# EAGLE board RePhone core 2G-Atmel32u4 v1.0 (EAGLE 6.4)
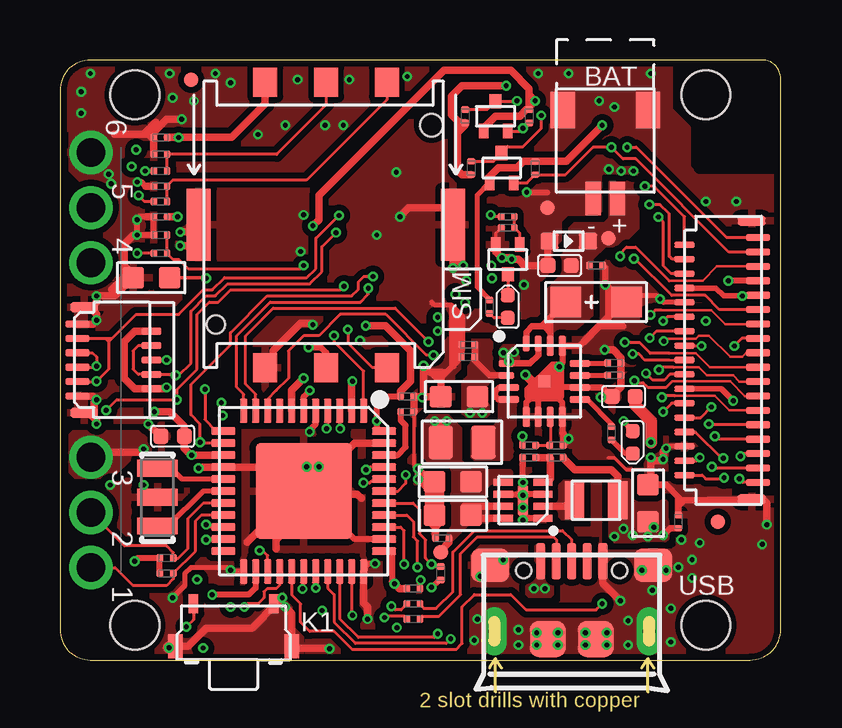
[diagram p2: board, top side]
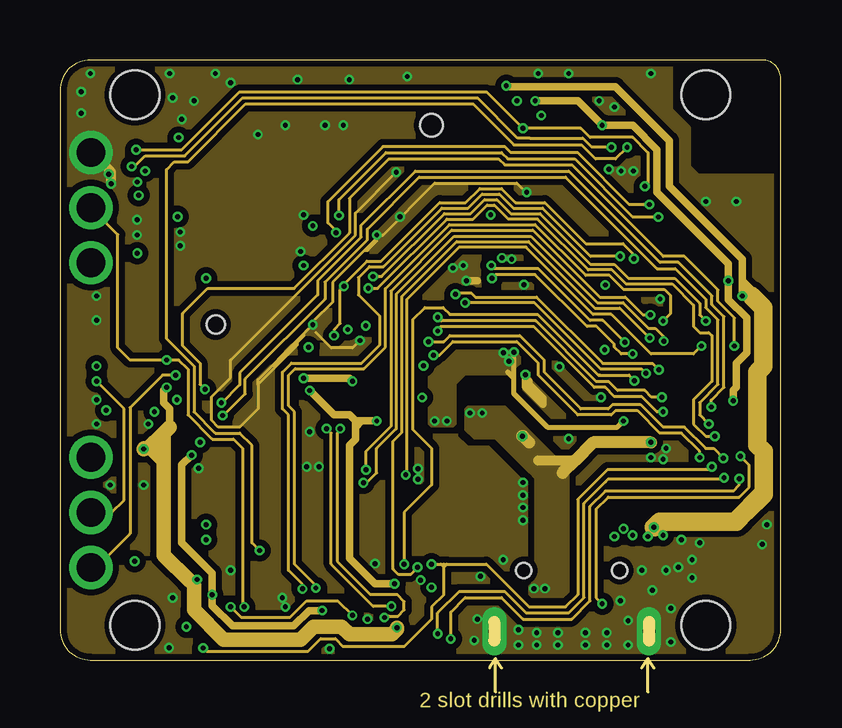
[diagram p3: board, inner layer Route2]
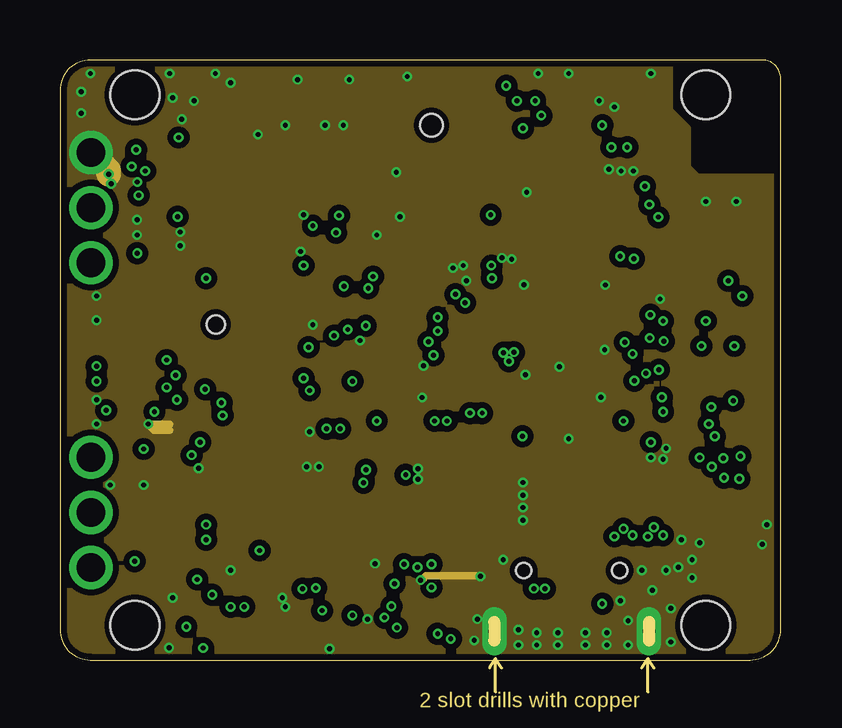
[diagram p4: board, inner layer GND]
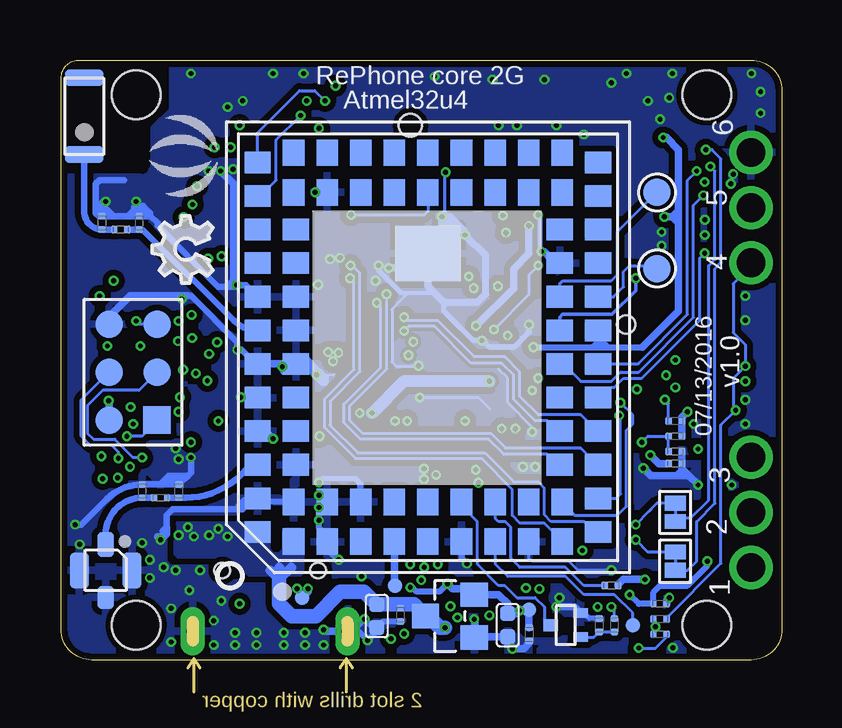
[diagram p5: board, bottom side, seen from below]

Size 30.05 x 25 mm. Coordinates in mm from the lower left corner, seen from the top.
Outline: 1.27,25 arc90 0,23.73 0,1.27 arc90 1.27,0 28.78,0 arc90 30.05,1.27 30.05,24.24 arc90 29.29,25 1.27,25
Copper layers (1*2*15*16): Top 0.035mm / dielectric 0.2mm / Route2 0.0175mm / dielectric 0.3mm / GND 0.0175mm / dielectric 0.2mm / Bottom 0.035mm
Design rules "SeeedStudio_4layer_DRU_no_angle_20140221 *": minimum track width 1mil, minimum drill 8mil, track to track 4mil, track to pad 4mil, pad to pad 5mil, via to via 5mil, smd to smd 0mil, copper to edge 10mil, drill to drill 6mil, minimum pad ring 6mil, minimum via ring 4mil, stop-mask expansion 4mil, vias tented up to drill 100mil, thermal gap 10mil
Holes 2.03 mm at 3.12,1.45 3.12,23.55 26.92,23.55 26.92,1.45
tRestrict: area 26.7,20.5 to 31.1,25.6
bRestrict: area 26.7,20.5 to 31.1,25.6

## Footprints (pad centres in the part's own frame; a part is rotated, then mirrored left to right if it is on the bottom)
ANT-SMD2P-3.2X1.6X1.04MM = smd 1.6 x 0.7: 1 0,1.6; 2 0,-1.6
C0201 = smd 0.279 x 0.318: 1 -0.279,0; 2 0.279,0
C0402 = smd 0.635 x 0.635: 1 0,0.484; 2 0,-0.484
C0603 = smd 0.889 x 0.889: 1 0,0.762; 2 0,-0.762
AVX-A = smd 1.27 x 1.27: + -1.27,0; - 1.27,0
LED-0402 = smd 0.58 x 0.58: + -0.468,0; - 0.468,0
SOD-523 = smd 0.762 x 0.7: + -0.8,0; - 0.8,0
ANT-IPEX4-1.7X1.7MM = smd 0.7 x 1.05: 1 0,-1.075 | smd 0.8 x 1.5: 2 1.1,0; 4 -1.1,0 | smd 0.7 x 0.95: 3 0,1.125
FPC11-SMD-0.3(FH35C) = smd 0.3 x 1: 1 -1.5,-3.075; 3 -0.9,-3.075; 5 -0.3,-3.075; 7 0.3,-3.075; 9 0.9,-3.075; 11 1.5,-3.075 | smd 0.3 x 0.85: 2 -1.2,0; 4 -0.6,0; 6 0,0; 8 0.6,0; 10 1.2,0 | smd 0.4 x 1.15: P$1 2.2,-2.8; P$2 -2.2,-2.8
MICRO-USB5+4P-SMD-0.65-B = smd 0.381 x 1.524: 1 -1.3,-0.25; 2 -0.65,-0.25; 3 0,-0.25; 4 0.65,-0.25; 5 1.3,-0.25 | smd 1.6 x 1.397: S1 -3.4,-0.427; S6 3.4,-0.427 | drill 0.508 pad 1.016 long: S2 -3.226,-3.175; S5 3.226,-3.175 | smd 1.5 x 1.5: S3 -1,-3.5; S4 1,-3.5 | hole 0.635: -2,-0.65; 2,-0.65
FPC35-SMD-0.3(FH26W) = smd 0.3 x 1: 1 -5.1,-1.551; 3 -4.5,-1.551; 5 -3.9,-1.551; 7 -3.3,-1.551; 9 -2.7,-1.551; 11 -2.1,-1.551; 13 -1.5,-1.551; 15 -0.9,-1.551; 17 -0.3,-1.551; 19 0.3,-1.551; 21 0.9,-1.551; 23 1.5,-1.551; 25 2.1,-1.551; 27 2.7,-1.551; 29 3.3,-1.551; 31 3.9,-1.551; 33 4.5,-1.551; 35 5.1,-1.551 | smd 0.254 x 0.851: 2 -4.8,1.524; 4 -4.2,1.524; 6 -3.6,1.524; 8 -3,1.524; 10 -2.4,1.524; 12 -1.8,1.524; 14 -1.2,1.524; 16 -0.6,1.524; 18 0,1.524; 20 0.6,1.524; 22 1.2,1.524; 24 1.8,1.524; 26 2.4,1.524; 28 3,1.524; 30 3.6,1.524; 32 4.2,1.524; 34 4.8,1.524 | smd 0.4 x 1.15: P$1 5.8,-1.276; P$2 -5.8,-1.276
HW2-SMD-1.0-90D = smd 1.524 x 1.016: 3 -3.429,1.778; 4 -3.429,-1.778 | smd 1.397 x 0.635: + 0.254,0.508; - 0.254,-0.508
H2X3-SMD-2.0(1.143) = smd 1.143 x 1.143: 1 -1,2; 2 -1,0; 3 -1,-2; 4 1,-2; 5 1,0; 6 1,2
3P-DIP-2 = drill 1.2 pad 1.8: 1 -2.3,-0.02; 2 0,-0.02; 3 2.3,-0.02
SW4-SMD-4.5X3.8X1.8MM-90D = smd 0.4 x 0.8: 1 -1.675,-1.277; 2 1.675,-1.277 | smd 0.6 x 1: S1 -2.425,0.5; S2 2.425,0.5
L0805 = smd 1.016 x 1.397: 1 -0.889,0; 2 0.889,0
L201610 = smd 0.8 x 1.6: 1 -0.9,0; 2 0.9,0
SOT-523 = smd 0.4 x 0.6: 1 0.5,0.62; 2 -0.5,0.62 | smd 0.5 x 0.6: 3 0,-0.62
R0201 = smd 0.279 x 0.318: 1 -0.279,0; 2 0.279,0
NANO-SIM6+2P-SMD-12.3X10X1.5MM = smd 1 x 1.2: 1 6.94,-1.8; 2 4.4,-1.8; 3 1.86,-1.8; 5 6.94,10.1; 6 4.4,10.1; 7 1.86,10.1 | smd 1 x 3: 4 9.71,4.15; 8 -0.9,4.15 | hole 0.95: 0,0 | hole 0.75: 9,8.3
TP-D23MIL = smd 0.6 x 0.6: T 0,0
TP-D45MIL = smd 1.143 x 1.143: T 0,0
GPRS88-SMD-1.4-17.8X45.8X2.4MM = smd 1.1 x 0.9: 1 -8.1,5.6; 2 -8.1,4.2; 3 -8.1,2.8; 4 -8.1,1.4; 5 -8.1,0; 6 -8.1,-1.4; 7 -8.1,-2.8; 8 -8.1,-4.2; 9 -8.1,-5.6; 22 8.1,-5.6; 23 8.1,-4.2; 24 8.1,-2.8; 25 8.1,-1.4; 26 8.1,0; 27 8.1,1.4; 28 8.1,2.8; 29 8.1,4.2; 30 8.1,5.6; 43 -6.45,5.6; 44 -6.45,4.2; 45 -6.45,2.8; 46 -6.45,1.4; 47 -6.45,0; 48 -6.45,-1.4; 49 -6.45,-2.8; 50 -6.45,-4.2; 51 -6.45,-5.6; 60 6.45,-5.6; 61 6.45,-4.2; 62 6.45,-2.8; 63 6.45,-1.4; 64 6.45,0; 65 6.45,1.4; 66 6.45,2.8; 67 6.45,4.2; 68 6.45,5.6 | smd 0.9 x 1.1: 10 -7.7,-7.1; 11 -6.3,-7.1; 12 -4.9,-7.1; 13 -3.5,-7.1; 14 -2.1,-7.1; 15 -0.7,-7.1; 16 0.7,-7.1; 17 2.1,-7.1; 18 3.5,-7.1; 19 4.9,-7.1; 20 6.3,-7.1; 21 7.7,-7.1; 31 7.7,7.1; 32 6.3,7.1; 33 4.9,7.1; 34 3.5,7.1; 35 2.1,7.1; 36 0.7,7.1; 37 -0.7,7.1; 38 -2.1,7.1; 39 -3.5,7.1; 40 -4.9,7.1; 41 -6.3,7.1; 42 -7.7,7.1; 52 -4.9,-5.5; 53 -3.5,-5.5; 54 -2.1,-5.5; 55 -0.7,-5.5; 56 0.7,-5.5; 57 2.1,-5.5; 58 3.5,-5.5; 59 4.9,-5.5; 69 4.9,5.5; 70 3.5,5.5; 71 2.1,5.5; 72 0.7,5.5; 73 -0.7,5.5; 74 -2.1,5.5; 75 -3.5,5.5; 76 -4.9,5.5 | smd 2.3 x 2.7: 83 3.9,0
SOT-23 = smd 1.016 x 1.143: 1 -0.889,-1.016; 2 0.889,-1.016; 3 0,1.016
QFN16GA-0.5-3X3MM = smd 0.65 x 0.28: 1 -1.575,0.75; 2 -1.575,0.25 | smd 0.85 x 0.28: 3 -1.475,-0.25; 4 -1.475,-0.75; 9 1.475,-0.75; 10 1.475,-0.25; 11 1.475,0.25; 12 1.475,0.75 | smd 0.28 x 0.85: 5 -0.75,-1.475; 6 -0.25,-1.475; 7 0.25,-1.475; 8 0.75,-1.475; 13 0.75,1.475; 14 0.25,1.475 | smd 0.28 x 0.65: 15 -0.25,1.575; 16 -0.75,1.575 | smd 0.508 x 0.508: PAD 0,0
QFN44G-0.5-7X7MM = smd 1 x 0.3: 1 -3.35,2.5; 2 -3.35,2; 3 -3.35,1.5; 4 -3.35,1; 5 -3.35,0.5; 6 -3.35,0; 7 -3.35,-0.5; 8 -3.35,-1; 9 -3.35,-1.5; 10 -3.35,-2; 11 -3.35,-2.5; 23 3.35,-2.5; 24 3.35,-2; 25 3.35,-1.5; 26 3.35,-1; 27 3.35,-0.5; 28 3.35,0; 29 3.35,0.5; 30 3.35,1; 31 3.35,1.5; 32 3.35,2; 33 3.35,2.5 | smd 0.3 x 1: 12 -2.5,-3.35; 13 -2,-3.35; 14 -1.5,-3.35; 15 -1,-3.35; 16 -0.5,-3.35; 17 0,-3.35; 18 0.5,-3.35; 19 1,-3.35; 20 1.5,-3.35; 21 2,-3.35; 22 2.5,-3.35; 34 2.5,3.35; 35 2,3.35; 36 1.5,3.35; 37 1,3.35; 38 0.5,3.35; 39 0,3.35; 40 -0.5,3.35; 41 -1,3.35; 42 -1.5,3.35; 43 -2,3.35; 44 -2.5,3.35 | smd 4 x 4: TAB 0,0
DFN8G-0.5-2X2MM = smd 0.8 x 0.3: 1 -0.827,0.75; 2 -0.827,0.25; 3 -0.827,-0.25; 4 -0.827,-0.75; 5 0.827,-0.75; 6 0.827,-0.25; 7 0.827,0.25; 8 0.827,0.75 | smd 0.45 x 1.3: 9 0,0
2P-SMD-SHORT = smd 0.889 x 0.61: 1 0,0.381; 2 0,-0.381
RESONATOR3-SMD-3.6X1.3X0.8MM = smd 0.7 x 1.7: 1 -1.2,0; 2 0,0; 3 1.2,0

## Placement (x,y rotation side)
BT  AN3216  [ANT-SMD2P-3.2X1.6X1.04MM]  29.08,22.66 180 bottom
C1  100nF  [C0201]  15.9,1.88 90 bottom
C2  100nF  [C0201]  4.19,21.77 180 top
C3  27pF  [C0201]  4.19,19.74 0 top
C4  1uF  [C0402]  11.43,1.45 180 bottom
C5  10uF  [C0603]  24.51,6.53 0 top
C6  27pF  [C0201]  4.19,21.07 0 top
C7  27pF  [C0201]  4.19,17.71 0 top
C9  10uF  [C0603]  16.64,10.98 270 top
C10  100nF  [C0201]  17.02,12.63 180 top
C13  10uF  [C0603]  16.38,7.42 270 top
C14  100nF  [C0201]  4.19,18.47 180 top
C15  1uF  [C0402]  16.89,1.83 180 bottom
C16  100nF  [C0201]  10.54,1.07 90 bottom
C18  22uF  [AVX-A]  22.35,14.91 0 top
C19  100nF  [C0201]  25.78,5.77 270 top
C21  10uF  [C0603]  16.38,6.02 90 top
C22  DNP  [C0201]  26.67,7.04 90 bottom
C23  1uF  [C0402]  23.5,10.98 270 top
C24  100nF  [C0201]  22.35,16.44 0 top
C25  1uF  [C0402]  20.83,16.44 270 top
C26  4.7uF  [C0603]  3.81,15.93 270 top
C27  100nF  [C0201]  15.94,5.07 0 top
C28  DNP  [C0201]  25.15,7.04 90 bottom
C29  DNP  [C0201]  28.35,18.21 270 bottom
C30  DNP  [C0201]  26.8,18.21 270 bottom
C44  100nF  [C0201]  4.45,8.18 180 bottom
C45  100nF  [C0201]  14.73,2.97 180 top
C46  100nF  [C0201]  5.08,2.34 180 bottom
C47  100nF  [C0201]  14.48,10.98 180 top
C48  100nF  [C0201]  14.48,10.34 180 top
C49  1uF  [C0402]  4.7,9.32 90 top
C50  100nF  [C0201]  4.45,8.69 180 bottom
D1  Green  [LED-0402]  23.88,9.07 270 top
D2  Prisemi;PZ5D4V2H  [SOD-523]  21.21,17.45 0 top
D3  BLue  [LED-0402]  18.67,14.72 90 top
FR1  [SEEEDSTUDIO-PCB-FRAME]  -15.87,-50.49 0 top  (outside the outline)
FR2  [SEEEDSTUDIO-PCB-FRAME]  -15.75,-18.23 0 top  (outside the outline)
GSM  IPEX  [ANT-IPEX4-1.7X1.7MM]  28.19,3.74 180 bottom
J1  FH35C-11S-0.3SHW(50)  [FPC11-SMD-0.3(FH35C)]  3.81,12.5 270 top
J2  Micro-USB  [MICRO-USB5+4P-SMD-0.65-B]  21.34,4.37 0 top
J3  FH26-35S-0.3SHW  [FPC35-SMD-0.3(FH26W)]  27.56,12.5 90 top
J4  SMD FEMALE JST;2P-1.0-90D  [HW2-SMD-1.0-90D]  22.73,19.48 270 top
J6  ISP  [H2X3-SMD-2.0(1.143)]  27.05,11.99 180 bottom
J9  DNP  [3P-DIP-2]  1.27,18.85 90 top
J10  DNP  [3P-DIP-2]  1.27,6.15 90 top
K1  BUTTON-2P-REINFORCE;HQ-TP-1100A  [SW4-SMD-4.5X3.8X1.8MM-90D]  7.24,1.07 180 top
L3  2.2uH  [L0805]  16.76,9.07 180 top
L4  0.47uH  [L201610]  22.35,6.66 0 top
Q4  CJ1012  [SOT-523]  18.67,16.69 0 top
Q5  CJ1012  [SOT-523]  9.02,1.45 270 bottom
Q7  CJ1012  [SOT-523]  18.41,20.5 180 top
Q8  CJ1012  [SOT-523]  18.16,22.66 180 top
R1  4.7k  [R0201]  6.98,1.45 270 bottom
R2  51R  [R0201]  4.19,19.1 0 top
R3  51R  [R0201]  4.19,20.37 0 top
R4  51R  [R0201]  4.19,16.95 180 top
R5  DNP  [R0201]  4.45,9.96 180 bottom
R6  4.7k  [R0201]  17.14,20.5 90 top
R7  4.7k  [R0201]  17.91,14.72 90 top
R8  4.7k  [R0201]  16.89,22.66 90 top
R9  47k  [R0201]  18.67,18.01 180 top
R10  4.7k  [R0201]  19.81,20.5 270 top
R11  220k_1%  [R0201]  20.7,8.44 0 top
R12  DNP  [R0201]  5.08,1.71 0 bottom
R13  47k  [R0201]  7.62,1.45 90 bottom
R14  4.7k  [R0201]  18.67,18.47 0 top
R15  0R  [R0201]  5.08,1.07 0 bottom
R16  4.7k  [R0201]  15.88,3.61 90 top
R17  4.7k  [R0201]  7.11,3.1 0 bottom
R18  0R  [R0201]  27.56,17.94 180 bottom
R22  0R  [R0201]  25.91,6.76 180 bottom
R25  10k_1%  [R0201]  4.45,9.32 0 bottom
R26  4.7k  [R0201]  4.45,3.61 180 top
R27  4.7k  [R0201]  4.45,4.24 180 top
R28  4.7k  [R0201]  19.56,22.66 270 top
R29  39k_1%  [R0201]  19.56,8.44 0 top
R35  2k  [R0201]  23.11,12.37 0 top
R36  2k  [R0201]  23.11,11.87 0 top
R37  2k  [R0201]  22.99,9.45 90 top
R38  DNP  [R0201]  19.56,8.94 180 top
R39  0R  [R0201]  20.7,8.94 0 top
R40  1M  [R0201]  17.02,13.13 180 top
R41  22R  [R0201]  14.73,1.71 180 top
R42  22R  [R0201]  14.73,2.34 180 top
SIM  Nano SIM CARD CONNECTOR 6Pin SMT TYPE  [NANO-SIM6+2P-SMD-12.3X10X1.5MM]  15.49,22.28 180 top
TP1  [TP-D23MIL]  16.13,3.1 90 bottom
TP2  [TP-D45MIL]  5.21,19.48 90 bottom
TP3  [TP-D45MIL]  5.21,16.31 90 bottom
TP4  [TP-D23MIL]  6.22,1.45 90 bottom
TP5  [TP-D23MIL]  20.02,2.59 0 bottom
TP6  [TP-D23MIL]  15.88,4.5 0 top
TP7  [TP-D23MIL]  10.54,2.09 0 bottom
TP8  [TP-D23MIL]  27.43,5.77 0 top
TP9  [TP-D23MIL]  5.46,24.18 0 top
TP10  [TP-D23MIL]  22.86,17.58 270 top
TP11  [TP-D23MIL]  20.32,18.85 90 top
U1  SIM800H  [GPRS88-SMD-1.4-17.8X45.8X2.4MM]  14.76,13.03 90 bottom
U2  XC6206P332MR  [SOT-23]  13.84,1.83 90 bottom
U3  ETA6003  [QFN16GA-0.5-3X3MM]  20.19,11.61 0 top
U4  ATMEGA32U4-MUR  [QFN44G-0.5-7X7MM]  10.16,7.04 270 top
U6  ETA3410  [DFN8G-0.5-2X2MM]  19.3,6.66 180 top
U$1  [SEEEDSTUDIO-PCB-FRAME]  -16.26,-42.36 0 top  (outside the outline)
U$2  [SEEED-SILK-160*153MIL]  25.04,21.03 90 bottom
U$3  [SEEEDSTUDIO-PCB-FRAME]  -16.26,-35.25 0 top  (outside the outline)
U$5  [SEEEDSTUDIO-PCB-FRAME]  -16,-26.62 0 top  (outside the outline)
U$14  [OSHW_FILLX100_NOTEXT]  23.72,15.7 90 bottom
U$21  JUMPER-2P-SHORT  [2P-SMD-SHORT]  4.45,6.15 180 bottom
U$42  JUMPER-2P-SHORT  [2P-SMD-SHORT]  4.45,4.12 180 bottom
X1  16MHz-15pF-0.5%-40R  [RESONATOR3-SMD-3.6X1.3X0.8MM]  4.06,6.79 90 top

## Tracks (layer width: path | path; a pad name or v marks a point on that pad's centre or on a via)
3V3  (via drill 0.2 pad 0.36)
  Top 0.203: R7.2 17.91,15.04 17.4,15.55 17.4,19.37 Q7.1
  Top 0.229: J3.14 27.56,11.3 v28.07,10.8
  Top 0.254: U4.6 10.16,10.98 v10.41,11.23 | U4.24 8.16,3.01 7.87,2.72 v6.35,2.72 | R26.2 R27.2 3.24,4.24 v3.11,4.12 | U4.44 13.38,9.54 13.21,9.71 v13.21,9.96 13.21,10.6 13.59,10.98 C47.2 | J3.29 v27.87,15.8 v27.86,15.8 | U4.34 13.68,4.54 13.84,4.37 13.84,3.28 v13.95,3.18 | R16.1 15.8,3.33 v15.49,3.03
  Top 0.305: U4.14 v5.48,8.54 5.46,8.54 5.18,8.82 C49.2 5.18,9.73 4.57,10.34 v3.94,10.34 | C47.2 14.2,11.21 14.61,11.61 14.61,12.88 13.56,13.92 v12.75,13.92 | Q7.1 17.91,20.13 18.29,20.5 19.05,20.5 19.33,20.78 R10.1 21.11,20.78 v22.61,22.28 | 19.56,23.55 v19.81,23.3 19.56,23.04 R28.1 | C45.2 14.15,2.97 v13.95,3.18 | v10.54,18.09 10.79,18.34 10.79,19.36 16,24.56 18.8,24.56 19.56,23.8 19.56,23.55 | Q8.1 17.66,22.16 18.16,22.66 19.18,22.66 19.46,22.94 R28.1 | R28.1 19.56,23.55
  Route2 0.305: 5.46,8.52 v5.48,8.54 5.08,8.13 5.08,4.88 6.35,3.61 v6.35,2.72 6.35,2.27 7.19,1.42 9.75,1.42 10.39,2.06 v10.94,2.06 | 12.32,9.71 12.32,9.2 12.07,8.94 12.07,4.24 13.13,3.18 v13.95,3.18 | 12.32,9.71 12.32,9.96 | v10.41,11.23 11.43,10.21 12.07,10.21 12.32,9.96 | v19.81,23.3 21.59,23.3 v22.61,22.28 23.88,22.28 24.89,21.26 24.89,19.48 27.86,16.51 v27.86,15.8 27.86,15.02 28.63,14.25 28.63,12.8 28.19,12.37 28.19,11.36 28.07,11.23 v28.07,10.8 | 12.32,9.96 12.57,9.96 | 12.57,9.96 v13.21,9.96 | 12.57,9.96 12.32,9.71
  Bottom 0.254: 13.08,2.97 U2.2 | v6.35,2.72 5.97,2.34 C46.2 5.36,2.82 5.08,3.1 3.94,3.1 3.11,3.93 v3.11,4.12 | 13.97,3.2 v13.95,3.18 14.28,2.85 15.24,2.85 15.42,3.03 v15.49,3.03
  Bottom 0.305: U2.2 11.81,2.72 11.43,2.34 C4.2 11.06,1.94 v10.94,2.06 10.91,2.09 TP7.T C16.2 | v5.48,8.54 5.13,8.18 C44.2 | R25.2 R5.1 4.17,10.11 v3.94,10.34 | J6.6 28.05,10.78 v28.07,10.8 | 13.08,2.97 13.74,2.97 v13.95,3.18 | v12.75,13.92 11.18,15.5 11.18,16.31 10.54,16.95 v10.54,18.09
!RESET  (via drill 0.2 pad 0.36)
  Top 0.127: U4.13 5.87,9.04 v5.84,9.07 5.84,9.83 5.46,10.21 5.46,11.48 7.11,13.13 7.11,13.64 8.64,15.17 12.17,15.17 12.45,15.45 12.45,15.75 12.68,15.98 v13.06,15.98
  Route2 0.127: v26.92,14.13 26.67,14.38 26.67,14.86 25.63,15.9 23.7,15.9 23.11,16.49 22.12,16.49 20.02,18.6 18.8,18.6 18.21,19.18 17.7,19.18 17.12,18.6 16.03,18.6 13.41,15.98 v13.06,15.98
  Bottom 0.127: C50.2 4.72,9.3 4.7,9.32 R25.1 5.59,9.32 v5.84,9.07 | 26.05,14.01 J6.3 26.79,13.99 v26.92,14.13
AREF
  Top 0.254: C48.2 14.2,9.98 14.41,9.77 14.41,8.88 14.07,8.54 U4.42
D0/RXD_3V3  (via drill 0.2 pad 0.36)
  Top 0.127: Q7.2 19.47,19.88 R10.2 21.08,20.22 22.23,21.37 v22.99,21.37 23.47,20.88 24,20.88 27.89,17 J3.33 29.13,17.02 J3.33
  Route2 0.127: v2.98,20.56 3.11,20.56 3.56,21.01 5.21,21.01 7.62,23.42 17.4,23.42 19.07,21.75 19.58,21.75 21.79,21.75 22.17,21.37 v22.99,21.37
  Bottom 0.127: U$21.1 4.32,5.9 3.81,5.9 3.05,6.66 3.05,16.44 2.79,16.69 2.79,20.37 v2.98,20.56
D0/RXD_MCU  (via drill 0.2 pad 0.36)
  Top 0.127: U4.20 6.2,5.54 v6.1,5.64
  Bottom 0.127: v6.1,5.64 5.52,6.21 5.46,6.28 5.21,6.53 U$21.2
D1/TXD_3V3  (via drill 0.2 pad 0.36)
  Top 0.127: Q8.2 19.19,22.04 v19.3,22.15 19.53,22.38 R28.2 | J3.34 26.04,18.47 24.77,19.74 v24.38,19.74
  Route2 0.127: v3.18,21.26 5.08,21.26 7.49,23.68 17.78,23.68 v19.3,22.15 21.72,22.15 22.1,21.77 23.88,21.77 24.51,21.14 24.51,19.87 v24.38,19.74
  Bottom 0.127: U$42.1 3.94,3.74 3.56,4.12 3.56,5.77 2.79,6.53 2.79,16.31 2.54,16.56 2.54,20.88 2.92,21.26 v3.18,21.26
D1/TXD_MCU  (via drill 0.2 pad 0.36)
  Top 0.127: U4.21 6.13,5.04 v6.1,5.01
  Bottom 0.127: v6.1,5.01 5.59,4.5 U$42.2
D2/SDA  (via drill 0.2 pad 0.36)
  Top 0.127: U4.19 5.89,6.04 5.65,5.8 5.65,4.54 R26.1 4.72,3.38 4.45,3.1 3.05,3.1 2.3,3.85 J10.1 | J1.4 3.27,13.1 3.05,12.88 3.05,12.12 3.27,11.9 J1.8 4.79,11.9 v4.83,11.87 4.95,11.87 5.46,12.37 5.46,14.53 6.1,15.17 6.48,15.17 6.98,15.68 10.41,15.68 10.92,16.18 10.92,17.22 v11.51,17.81 | J3.32 25.52,16.7 25.4,16.82 25.4,18.6 25.02,18.98 v24.58,18.98
  Route2 0.127: J10.1 1.51,3.85 2.92,5.26 2.92,10.52 4.27,11.87 v4.83,11.87 | v24.58,18.98 23.75,18.98 21.59,21.14 18.8,21.14 18.54,21.39 13.46,21.39 11.18,19.1 11.18,18.21 11.51,17.88 v11.51,17.81
D3/SCL  (via drill 0.2 pad 0.36)
  Top 0.127: U4.18 5.97,6.54 5.33,5.9 5.33,4.65 4.93,4.24 R27.1 4.72,4.47 4.45,4.75 2.69,4.75 J10.2 | 2.03,13.4 2.03,13.26 | 2.03,13.26 2.03,12.12 v1.52,11.61 v1.51,11.6 J1.9 | J1.3 2.03,13.4 | 2.03,13.4 2.17,13.4 3.18,14.4 4.95,14.4 5.97,15.42 6.35,15.42 6.86,15.93 10.29,15.93 10.67,16.31 10.67,17.58 11.61,18.52 v11.63,18.52 | 2.03,13.26 1.9,13.39 | 2.03,13.26 2.16,13.39 | J3.30 25.48,16.1 25.15,16.44 25.15,18.25 v24.94,18.46
  Route2 0.127: J10.2 2.16,6.15 2.67,6.66 2.67,10.47 v1.52,11.61 | v24.94,18.46 23.89,18.46 21.46,20.88 18.67,20.88 18.41,21.14 13.59,21.14 11.63,19.18 v11.63,18.52
D4  (via drill 0.2 pad 0.36)
  Top 0.127: v8.32,4.56 8.45,4.56 8.66,4.35 U4.25 | J3.35 27.79,17.6 24.03,21.37 v23.65,21.37
  Route2 0.127: v8.32,4.56 8,4.88 8,8.94 7.49,9.45 6.48,9.45 5.59,10.34 5.59,12.25 4.45,13.39 4.45,20.44 4.76,20.76 5.33,20.76 7.75,23.17 17.22,23.17 18.92,21.47 19.63,21.47 21.74,21.47 22.33,20.88 23.16,20.88 v23.65,21.37
D5  (via drill 0.2 pad 0.36)
  Top 0.127: U4.31 11.66,1.73 12.45,0.94 15.6,0.94 v15.75,1.1 | J3.2 26.77,7.7 26.92,7.55 27.63,7.55 v27.69,7.6
  Route2 0.127: v15.75,1.1 15.75,1.96 16.64,2.85 18.54,2.85 19.43,1.96 21.21,1.96 21.84,2.59 21.84,6.52 22.74,7.42 22.74,7.43 22.86,7.55 27.63,7.55 v27.69,7.6
D6/PWM  (via drill 0.2 pad 0.36)
  Top 0.127: U4.27 9.66,2.71 10.03,2.34 10.03,1.58 10.41,1.2 11.43,1.2 12.19,0.44 16.51,0.44 16.76,0.69 16.76,2.21 17.27,2.72 18.8,2.72 19.43,2.09 22.35,2.09 v22.61,2.34 | J3.5 28.48,8.6 v28.37,8.49
  Route2 0.127: v22.61,2.34 22.35,2.59 22.35,6.28 22.86,6.79 28.32,6.79 28.74,7.2 28.74,8.12 v28.37,8.49
D7/INT6  (via drill 0.2 pad 0.36)
  Top 0.127: J1.7 1.48,12.2 v1.52,12.25 1.52,12.63 1.35,12.8 J1.5 | U4.1 12.66,12.03 11.43,13.26 v11.43,13.52 | J3.25 27.49,14.6 26.9,15.19 25.5,15.19 23.98,16.72 v23.93,16.72 | v1.93,10.4 2.38,10.85 v4.88,10.85 4.88,11.28 5.71,12.12 5.71,14.4 6.22,14.91 6.6,14.91 7.11,15.42 11.68,15.42 v11.84,15.57
  Route2 0.127: v23.93,16.72 23.93,16.89 23.47,17.35 21.92,17.35 20.22,19.05 19,19.05 18.41,19.64 17.5,19.64 16.92,19.05 15.82,19.05 13.39,16.62 12.8,16.62 11.84,15.65 v11.84,15.57 11.68,15.42 11.68,14.02 11.43,13.77 v11.43,13.52
  Bottom 0.127: R5.2 4.72,10.7 v4.88,10.85 | J9.1 1.29,16.42 2.03,15.68 2.03,13.64 1.52,13.13 v1.52,12.25 2.03,11.74 2.03,10.51 v1.93,10.4 2.54,9.79 2.54,4.03 4.8,1.77 R12.2
D8  (via drill 0.2 pad 0.36)
  Top 0.102: J3.31 27.39,16.4 26.8,15.8 25.4,15.8
  Top 0.127: U4.28 10.16,3.01 v10.11,2.96 | 25.4,15.8 24,17.2 23.62,17.2 23.36,16.93 v23.36,16.82
  Route2 0.127: v23.36,16.82 22.12,16.82 20.12,18.82 18.9,18.82 18.31,19.41 17.6,19.41 17.02,18.82 15.93,18.82 13.49,16.39 12.9,16.39 12.45,15.93 12.45,15.22 13.34,14.33 13.34,13.13 12.57,12.37 9.65,12.37 9.27,11.99 9.27,10.47 9.53,10.21 9.53,3.74 10.11,3.15 v10.11,2.96
D9  (via drill 0.2 pad 0.36)
  Top 0.127: U4.29 v10.66,3.01 v10.67,3 | J3.24 25.32,14.3 v25.15,14.13
  Route2 0.127: v25.15,14.13 25.45,14.43 25.45,15.19 25.2,15.45 23.5,15.45 22.91,16.03 21.92,16.03 19.81,18.14 16.23,18.14 13.56,15.47 13.56,13.03 12.68,12.14 9.81,12.14 9.53,11.86 9.53,10.6 9.78,10.34 9.78,3.99 10.67,3.1 v10.67,3
D10  (via drill 0.2 pad 0.36)
  Top 0.127: v16.29,0.88 16.1,0.69 12.32,0.69 11.43,1.58 11.43,2.72 11.16,2.99 U4.30 | J3.1 28.47,7.4 v28.32,7.55
  Route2 0.127: v16.29,0.88 16.29,2 16.89,2.59 18.41,2.59 19.3,1.71 21.34,1.71 22.1,2.47 22.1,6.4 22.73,7.04 28.07,7.04 28.32,7.29 v28.32,7.55
D11  (via drill 0.2 pad 0.36)
  Top 0.127: U4.12 6.52,9.54 6.04,10.01 v6.04,11.28 | J3.21 28.43,13.4 v28.12,13.08
  Route2 0.127: v28.12,13.08 28.12,14.25 27.43,14.94 27.43,15.42 26.04,16.82 25.15,16.82 21.34,20.63 18.54,20.63 18.29,20.88 13.72,20.88 12.07,19.23 12.07,17.78 9.77,15.48 6.16,15.48 5.12,14.45 5.12,13.09 5.84,12.37 5.84,11.48 v6.04,11.28
D12  (via drill 0.2 pad 0.36)
  Top 0.127: U4.26 9.16,3.12 9.02,2.97 8.64,2.97 8.51,2.85 8.51,2.59 8.25,2.34 7.81,2.34 v7.68,2.21 | J1.6 v4.45,12.5
  Route2 0.127: J9.2 2.41,17.73 2.41,13.01 2.92,12.5 v4.45,12.5 4.95,12.5 5.33,12.12 5.33,10.21 6.35,9.2 7.24,9.2 7.62,8.82 7.62,2.28 v7.68,2.21
D13  (via drill 0.2 pad 0.36)
  Top 0.127: U4.32 12.16,1.89 v12.19,1.86
  Route2 0.127: v7.11,2.21 7.54,1.78 9.6,1.78 10.29,2.47 11.58,2.47 v12.19,1.86
  Bottom 0.127: R1.1 6.98,2.09 v7.11,2.21
D+  (via drill 0.2 pad 0.36)
  Top 0.127: U4.4 11.16,9.69 v11.11,9.64 | R42.2 14.45,2.31 14.22,2.09 13.97,2.09 v13.82,2.24
  Route2 0.127: v11.11,9.64 11.3,9.45 11.3,3.99 13.06,2.24 v13.82,2.24
D-  (via drill 0.2 pad 0.36)
  Top 0.127: U4.3 11.66,9.67 v11.68,9.64 | R41.2 14.45,1.73 14.35,1.83 13.59,1.83 v13.53,1.77
  Route2 0.127: v11.68,9.64 11.68,9.58 11.56,9.45 11.56,4.12 12.95,2.72 14.07,2.72 14.35,2.44 14.35,2.09 14.1,1.83 13.72,1.83 13.65,1.77 v13.53,1.77
GND  (via drill 0.2 pad 0.36)
  Top 0.127: 3.91,21.46 3.91,21.54 3.56,21.9 | 18.17,17.45 18.17,17.79 R9.2 | 15.15,11.31 15.15,10.99 v15.1,10.94
  Top 0.152: C48.1 14.76,8.03 14.86,7.93 | 24.64,7.93 23.62,7.93 23.11,8.44 22.86,8.44
  Top 0.203: C18.- 23.88,15.17 24.89,15.17 v25.02,15.04 25.16,14.9 J3.26 | U4.23 7.16,3.69 v7.11,3.74 6.98,3.86 5.46,3.86 5.21,3.61 5.21,3.1 v4.7,2.59 | 16.38,14.66 16.26,14.79 | 16.26,14.79 15.62,14.79 15.49,14.91 | J3.6 25.36,8.9 v25.27,8.82 | 16.26,14.79 16.32,14.79 16.51,14.6
  Top 0.254: U4.5 10.66,9.82 10.41,9.58 v10.41,9.52 | v13.13,4.02 12.85,4.02 12.7,3.86 12.7,3.73 U4.33 | U4.35 12.29,5.04 10.29,7.04 | C23.2 22.63,11.36 U3.10 20.57,11.36 | 20.57,11.36 20.44,11.36 20.32,11.48 U3.PAD | U3.PAD 20.94,12.36 U3.13 21.67,13.09 21.84,13.26 | v21.21,9.22 21.21,9.2 20.95,9.45 20.94,9.46 U3.8 20.94,10.73 20.57,11.1 20.57,11.36 | U3.5 19.44,10.73 19.81,11.1 19.81,11.23 19.94,11.36 | 19.94,11.36 U3.PAD | U3.6 19.94,11.36 | R29.1 19.28,7.42 v19.3,7.39 19.3,6.91 | U6.1 19.39,5.91 v19.3,5.82 U6.9 19.3,6.91 | U6.6 19.3,6.91 | U6.3 19.31,6.91 19.3,6.91 | 3.58,19.74 3.56,19.74 3.38,19.92 v3.23,19.92 | C14.2 C7.1 v3.21,17.71 | 3.62,18.47 3.34,18.47 v3.21,18.34 v3.21,17.71 | v3.21,17.71 3.05,17.71 | C45.1 15.01,3.3 v15.04,3.33 | v19.46,19.48 20.32,19.48
  Top 0.279: 16.74,13.11 C10.2 16.38,12.26 15.88,11.76 15.88,11.69 | 27.05,6.66 26.04,6.66 | 25.91,6.66 25.78,6.66 | C19.1 25.78,6.4 | 25.78,6.4 25.78,6.66 | 25.78,6.66 25.78,6.79 | 25.78,6.79 25.27,7.29 C5.1 | 15.62,11.99 16,11.99 | 26.04,6.66 25.91,6.66 | 25.91,6.66 25.78,6.79 | 26.04,6.66 25.78,6.4 | 15.38,7.53 v14.92,7.53 15.24,7.22 | 15.38,7.53 15.56,7.36 15.62,7.29 | 15.38,7.53 14.95,7.97 v14.92,7.97 14.92,7.61 14.99,7.55 | C21.1 15.62,6.15 | 15.43,7.1 15.49,7.17 | 22.48,13.9 22.86,13.9 | 22.86,13.9 23.5,13.9 | R39.2 20.98,9.43 20.95,9.45 | 22.86,15.55 22.78,15.62 v22.73,15.62 22.73,16.34 C24.2 | 22.86,15.55 23.37,15.04 | 22.86,15.55 22.86,13.9
  Top 0.305: C6.1 3.91,21.46 C2.2 3.91,22 | C14.2 3.62,18.47 | v5.02,17.83 5.49,17.83 SIM.4 | SIM.8 16.39,16.86 v16.82,16.44 | 18.17,17.45 Q4.2 18.17,17 18.41,16.75 18.8,16.75 18.86,16.69 19.11,16.69 19.37,16.44 C25.2 20.34,17.39 D2.+ | J2.5 22.64,3.2 v23.37,2.47 | 9.07,2.35 K1.1 9.02,2.34 8,1.32 6.1,1.32 5.34,0.57 K1.S2 | 9.07,2.35 9.26,2.35 v9.4,2.21 9.66,1.95 K1.S1 9.73,0.5 11.21,0.5 v11.24,0.47 | U4.33 12.66,2.38 12.83,2.21 v12.83,1.71 | X1.2 3.81,6.79 3.49,7.1 v3.49,7.29 | v5.78,7.99 5.83,8.04 U4.15 9.16,8.04 U4.TAB | U4.TAB 10.29,7.04 | J2.S1 18.24,3.95 v18.48,4.18 | 15.04,10.98 C47.1 C48.1 | 15.49,11.99 15.62,11.99 15.88,11.99 15.88,11.69 15.88,11.61 | 15.49,11.99 15.42,11.99 v15.15,12.26 15.15,11.31 15.15,11.01 15.11,10.98 C9.2 15.88,11.61 | 15.88,11.61 15.49,11.99 | 16.51,14.53 16.74,14.3 R40.2 16.64,13.13 16.51,13.01 | 16.51,14.53 16.38,14.66 | J1.P$1 1.18,10.3 | 1.18,10.3 1.52,9.96 v1.52,9.83 | 1.18,10.3 1.36,10.3 1.36,10.38 1.42,10.44 1.42,10.75 v1.52,10.85 1.37,11 J1.11 | J1.P$2 1.31,14.7 | 1.31,14.7 1.31,14.62 1.52,14.4 v1.52,14.15 1.37,14 J1.1 | C5.1 24.26,7.29 | 24.26,7.29 24.64,7.67 24.64,7.93 v24.64,8.44 24.77,8.31 25.15,8.31 v25.15,8.36 25.15,8.69 v25.27,8.82 | 24.49,7.06 24.26,7.29 | v22.55,10.95 22.58,10.98 C23.2 23.39,11.36 R36.2 R35.2 23.39,12.6 23.06,12.93 v22.71,12.93 | J3.P$2 29.3,6.7 29.46,6.53 v29.46,5.64 | R39.2 20.98,9 v21.21,9.22 | C13.2 15.56,7.36 15.49,7.29 15.49,7.17 | 21.84,13.26 22.48,13.9 23.5,14.91 C18.- 23.37,14.91 23.37,15.04 | 1.31,14.7 1.52,14.91 v1.52,15.17 2.29,15.17 C26.2 3.05,16.06 2.67,16.44 | 27.05,6.66 28.83,6.66 | 3.91,22 4.45,22.53 v5.08,22.53
  Top 0.305: 2.67,16.44 2.67,17.33 3.05,17.71 | 2.67,16.44 2.67,15.93 2.16,15.42 | 9.07,2.35 9.07,2.39 v9.27,2.59 | C49.1 4.19,9.32 v3.68,9.83 | C3.1 3.58,19.74 | 3.91,22 3.81,21.9 3.56,21.9 3.48,21.9 | 2.29,21.9 3.48,21.9 | 3.48,21.9 3.99,22.41 | 9.02,4.63 9.02,5.01 10.79,6.79 10.79,7.8 11.05,7.55 11.3,7.55 11.94,6.91 12.39,6.91 12.57,6.73 | 10.44,7.55 7.8,4.91 | C27.1 15.66,5.54 | 15.66,5.55 15.66,5.99 C21.1 | 15.66,5.54 15.43,5.77 | 15.66,5.54 15.66,5.55 | 15.66,5.55 15.81,5.71 | 16.51,13.01 16.51,12.5 | 16.51,13.01 16.51,14.53 | 16.38,12.26 16.38,14.67 | SIM.8 16.39,16.35 v16.38,16.34 | 10.19,7.95 v10.29,8.05 | SIM.5 8.55,12.29 8.89,12.63 8.89,12.88 10.03,14.02 10.54,14.02 v10.54,13.97 | v5.02,17.26 5.52,17.26 5.71,17.45 | SIM.8 16.39,18.59 16.13,18.85 14.54,18.85 v14.16,18.47 | U4.43 12.29,9.04 10.16,6.91 U4.TAB
  Top 0.356: v19.41,11.89 19.94,11.36
  Top 0.406: 20.32,11.48 19.81,11.48
  Top 0.508: K1.S2 4.61,0.57 v4.55,0.51
  Top 0.813: C21.1 C13.2
  Route2 0.127: 12.7,17.07 13.21,17.58 v13.21,17.71 13.46,17.71 15.62,19.87 19.05,19.87 19.43,19.48 | 12.7,17.07 11.37,15.74 11.37,14.91 10.54,14.09 v10.54,13.97 10.16,13.59 | 8.25,11.48 8.25,10.47 7.49,9.71 6.6,9.71 6.33,9.98 6.33,10.98 7.11,11.76 7.11,12.5 12.32,17.71 12.32,18.62 v14.02,20.32 | 8.25,11.48 9.91,13.13 9.91,13.34 | 9.91,13.34 10.16,13.59 | 12.7,17.07 12.83,17.07 13.21,17.45 | v12.51,13.31 12.5,13.31 12.19,13.01 11.3,13.01 10.67,13.64 | 8.25,11.48 8.25,11.69 9.91,13.34 | 10.16,13.59 10.16,13.49 8.91,12.25
  Route2 0.305: v19.41,11.89 19.41,11.38 20.13,10.66 20.13,10.91 19.56,11.48 19.56,11.61 | v16.94,15.8 17.4,15.8
  Route2 0.406: v2.13,19.84 2.13,20.34 1.27,21.2
  GND 0.305: 4.57,9.58 3.94,9.58 v3.68,9.83 4.57,9.83 | v15.04,3.33 15.09,3.33 15.27,3.51 17.5,3.51 v17.53,3.48
  GND 1.016: v2.03,20.25 2.03,20.41 J9.3
  Bottom 0.127: v7.11,3.74 8.51,3.74 8.89,4.12 10.41,4.12 10.56,4.26 U1.8 | 11.81,12.12 11.43,11.74 11.43,10.72 10.41,9.71 v10.41,9.52 10.41,9.45 | v15.1,10.94 12.66,10.94 12.19,10.47 | v20.83,12.22 20.83,12.37 20.85,12.4 20.85,11.97 | U1.67 v19.45,19.48 v19.46,19.48 | v14.02,20.32 14.07,20.27 14.07,18.57 v14.17,18.47 | 14.22,18.47 14.22,18.57 14.1,18.7 14.07,18.7 13.89,18.52 | 15.62,15.29 15.62,15.24 16.26,14.61 16.26,12.42 16.08,12.25 15.14,12.25 | v19.41,11.89 18.67,11.89
  Bottom 0.203: R13.2 8.03,1.73 8.25,1.95 Q5.2 | v10.16,18.55 10.16,18.44 10.08,18.37 10.08,17.07 v10.03,17.02 | 14.1,14.73 14.1,14.53 12.88,13.31 v12.51,13.31 12.5,13.31 | 14.1,14.73 14.1,14.91 | 14.1,14.73 13.95,14.89 | 16.82,16.42 v16.82,16.44 16.82,16.23 15.88,15.29 15.62,15.29 14.48,15.29 | 22.86,15.93 22.86,15.87 23.18,15.55
  Bottom 0.254: U1.6 13.36,4.24 v13.13,4.02 | C1.1 16.64,1.6 C15.1 | C15.1 17.04,1.35 v17.4,1.71 17.91,1.2 J2.S2 17.65,1.2 v17.27,0.82 16.89,1.2 C15.1 | U1.73 | U1.2 18.96,5.17 19.3,5.51 v19.3,5.82 19.3,6.24 U1.44 | U1.45 17.56,7.32 17.78,7.55 19.15,7.55 v19.3,7.39 | U1.43 21.64,6.58 21.84,6.79 21.84,6.75 U1.41 | v12.51,13.31 12.47,13.31 12.22,13.06 11.15,13.06 10.54,13.67 v10.54,13.97
  Bottom 0.279: v24.64,8.44 24.64,7.8 24.77,7.67 | 25.65,5.51 25.65,6.02 25.4,6.28 22.48,6.28 22.1,6.66 | v29.46,5.64 29.21,5.64 28.14,6.71 arc45 C22.2 C28.2 25.12,7.32 24.89,7.55 | 24.89,7.55 24.77,7.67 | 22.1,6.66 21.93,6.66 21.84,6.66 | 22.1,6.66 22.43,6.66 22.66,6.43 | 24.89,7.55 25.48,7.55 25.68,7.34 | 24.77,7.67 25.58,7.67 25.86,7.39 | C30.1 27.28,18.49 | 27.28,18.49 27.92,18.49 | 27.92,18.49 C29.1 28.47,18.49 28.6,18.62 28.6,19.84 28.45,19.99 27.43,19.99 | C30.1 26.8,18.98 v26.92,19.1 | 27.92,18.49 27.92,18.55 28.02,18.65 | 28.02,18.65 28.22,18.85 | 27.28,18.49 26.92,18.85 | C30.1 26.31,18.49 26.04,18.21 26.04,18.09 23.5,15.55 23.18,15.55 22.81,15.55 v22.73,15.62 22.35,15.62 U1.35 | 28.02,18.65 28.38,18.65 28.45,18.72 28.45,18.98 28.32,19.1 v28.19,19.1 | 24.77,15.17 24.64,15.17 22.71,13.24 v22.71,12.93 22.53,12.93 21.93,12.33 U1.37
  Bottom 0.305: U1.58 9.49,16.77 9.66,16.77 9.91,17.01 10.02,17.01 v10.03,17.02 | U1.83 14.75,16.95 14.73,16.95 14.17,17.5 v14.17,18.47 | U1.83 15.24,16.93 | 15.24,16.93 15.89,16.93 | v9.4,2.21 8.66,2.21 Q5.2 | 12.8,0.97 C4.1 11.43,0.66 v11.24,0.47 10.76,0.47 10.54,0.69 C16.1 | 12.8,0.97 U2.1 | 12.8,0.97 12.8,1.68 v12.83,1.71 | C50.1 C44.1 4.17,7.97 | 3.87,7.67 v3.49,7.29 | v5.78,7.99 5.46,7.67 4.38,7.67 | 4.38,7.67 4.19,7.67 | 4.19,7.67 3.87,7.67 | 4.17,7.89 4.17,7.7 4.19,7.67 | 4.17,7.97 3.87,7.67 | 4.17,7.97 4.17,7.89 | 4.17,7.89 4.38,7.67 | U1.2 18.96,4.66 v18.48,4.18 | J2.S2 19.05,1.2 v19.11,1.26 | J6.4 28.05,14.29 27.18,15.17 25.15,15.17 | v25.91,5.01 26.04,5.13 25.78,5.13 25.65,5.26 25.65,5.51 25.81,5.36 | U1.38 22.54,10.93 v22.55,10.95 | U1.73 U1.37 | U1.39 21.52,9.53 v21.21,9.22 | U1.83 14.76,15.57 14.48,15.29 14.1,14.91 12.7,14.91 12.37,15.24 12.37,16.87 v13.21,17.71 | 25.15,15.17 v25.02,15.04 | 25.15,15.17 24.77,15.17 | 21.93,6.66 U1.41 | v16.38,16.34 15.84,16.34 15.24,16.93 | C46.1 4.8,2.49 v4.7,2.59 | v22.73,15.62 22.73,15.68 22.86,15.8 22.86,15.93 22.86,19.84 v23.39,20.37 | v13.21,17.71 14.22,17.71 | v13.21,17.71 13.21,17.83 13.84,18.47 14.1,18.47 | 14.22,18.47 v14.17,18.47 | v14.17,18.47 14.1,18.47 | 14.1,18.47 14.1,18.37 13.77,18.04
  Bottom 0.406: 26.92,18.85 26.67,18.85 26.42,18.6 | U1.73 19.85,12.33 19.13,11.61 19.1,11.61 19.1,11.74 19.91,12.55
  other vias: 18.83,16.7 18.43,16.75 25.78,3.86 24.7,2.91 19.11,0.63 22.48,23.3 23.11,23.04 24.64,24.44 26.67,4.88 0.89,22.79 19.88,1.13 20.76,1.13 20.76,0.63 19.88,0.63 21.91,1.13 22.8,1.13 22.8,0.63 21.91,0.63 23.69,1.64 23.69,0.63 25.46,0.75 25.46,2.15 26.35,4.18 26.35,3.42 29.27,4.82 24.26,3.74 25.27,3.74 2.1,7.29 0.89,23.68 1.27,24.44 4.57,24.44 4.7,23.42 6.48,24.44 5.59,23.3 22.89,20.45 23.9,20.37 8.25,21.9 9.4,22.28 11.05,22.28 11.81,22.28 7.11,24.06 9.91,24.18 12.07,24.18 14.48,24.31 19.3,6.86 19.3,6.35 19.94,24.44 21.21,24.44 10.79,8.05 19.34,15.64
  pour Top (isolate 0.254, rank 2, no thermals): 4.19,2.97 10.16,2.97 10.16,-0.84 4.19,-0.84
  pour Top (isolate 0.254, rank 2, no thermals): 17.14,4.88 26.04,4.88 26.04,-0.84 17.14,-0.84
  pour Top (isolate 0.254, rank 2, no thermals): 19.69,25.84 25.4,25.84 25.4,21.39 19.69,21.39
  pour Top (isolate 0.254, rank 2, no thermals): 23.95,20.12 22.79,20.12 22.61,19.94 22.61,18.47 19.94,18.47 19.94,20.12 21.34,20.12 22.1,20.88 23.77,20.88 24.13,20.52 24.13,20.3
  pour Top (isolate 0.254, rank 3, no thermals): 20.45,18.34 19.81,18.34 19.56,18.09 19.56,16.06 19.81,15.8 20.7,15.8 20.95,16.06 20.95,18.09 20.7,18.34
  pour Top (isolate 0.254, rank 3, no thermals): 25.27,14.02 25.27,15.34 23.99,16.63 22.75,16.63 22.61,16.49 22.61,14.28 22.99,13.77 25.02,13.77
  pour Top (isolate 0.254, rank 2, no thermals): 2.29,19.61 1.14,19.61 0.38,20.37 0.38,22.02 0.63,22.28 2.16,22.28 2.54,21.9 2.54,19.87
  pour Bottom (isolate 0.254, rank 6): -0.63,25.84 25.4,25.84 25.4,22.91 26.16,22.15 26.16,20.51 26.55,20.12 30.48,20.12 30.48,-0.84 28.32,-0.84 -0.63,-0.84
  pour GND (isolate 0.254, rank 6, no thermals): -0.63,25.84 25.4,25.84 25.4,22.91 26.16,22.15 26.16,20.52 26.56,20.12 30.48,20.12 30.48,-0.84 -0.63,-0.84
  pour Top (isolate 0.254, rank 6): -0.63,25.84 25.4,25.84 25.4,22.91 26.16,22.15 26.16,20.51 26.55,20.12 30.48,20.12 30.48,-0.84 28.32,-0.84 -0.63,-0.84
  pour Route2 (isolate 0.254, rank 6, no thermals): -0.63,25.84 25.4,25.84 25.4,22.91 26.16,22.15 26.16,20.52 26.56,20.12 30.48,20.12 30.48,-0.84 27.56,-0.84 -0.63,-0.84
  pour Bottom (isolate 0.127, no thermals): 11.91,12.3 12.95,12.3 14.5,13.85 15.52,13.85 16.21,13.16 16.21,12.47 16.05,12.32 15.11,12.32 14.66,11.87 12.09,11.87 11.96,11.74 11.96,11 11.91,10.95 11.48,10.95 11.43,11 11.43,11.81
HP_IN_N  (via drill 0.2 pad 0.36)
  Top 0.102: J3.15 28.33,11.6 28.07,11.87 26.98,11.87 26.64,12.2 25.58,12.2
  Top 0.127: 25.58,12.2 25.07,12.2 v24.97,12.09
  Route2 0.127: v24.97,12.09 24.7,12.36 22.63,12.36 19.87,15.12 17.32,15.12 17.14,15.29 16.64,15.29 16.59,15.24 v16.48,15.24
  Bottom 0.127: U1.12 7.7,8.13 8.38,8.82 11.51,8.82 12.13,9.44 17.48,9.44 18.02,9.98 18.02,10.57 16.48,12.11 v16.48,15.24
HP_IN_P  (via drill 0.2 pad 0.36)
  Top 0.127: J3.16 25.44,11.9 25.2,11.66 24.71,11.66 v24.44,11.94
  Route2 0.127: v24.44,11.94 24.24,12.13 22.53,12.13 19.78,14.89 v16.89,14.89
  Bottom 0.127: U1.52 9.35,8.13 9.78,8.56 11.6,8.56 12.23,9.2 17.56,9.2 18.26,9.89 18.26,10.66 16.76,12.15 16.76,14.76 v16.89,14.89
HP_L  (via drill 0.2 pad 0.36)
  Top 0.127: J3.12 25.51,10.7 v25.15,10.34
  Route2 0.127: v25.15,10.34 24.89,10.34 24.26,10.98 23.11,10.98 22.73,11.36 22.28,11.36 19.74,13.9 15.88,13.9 15.75,13.77 v15.75,13.71
  Bottom 0.127: U1.53 9.35,9.53 9.78,9.96 10.29,9.96 11.18,10.85 11.18,11.87 11.68,12.37 12.95,12.37 14.48,13.9 15.56,13.9 v15.75,13.71
HP_R  (via drill 0.2 pad 0.36)
  Top 0.102: 25.63,11 27.3,11 27.91,10.4 J3.11
  Top 0.127: 25.63,11 25.15,11 v25.09,10.95
  Route2 0.127: v15.75,14.28 15.9,14.13 19.84,14.13 22.35,11.61 22.86,11.61 23.24,11.23 24.38,11.23 24.66,10.95 v25.09,10.95
  Bottom 0.127: U1.13 7.7,9.53 8.38,10.21 10.16,10.21 10.92,10.98 10.92,11.99 11.56,12.63 12.83,12.63 14.35,14.15 15.62,14.15 v15.75,14.28
MIC_N  (via drill 0.2 pad 0.36)
  Top 0.102: J3.17 27.1,12.2 26.52,12.78 25.4,12.78
  Top 0.127: 25.4,12.78 24.61,12.78 24.16,13.24 v23.55,13.24
  Route2 0.127: v23.55,13.24 22.63,14.15 22.1,14.15 19.94,16.31 18.11,16.31 v17.98,16.44
  Bottom 0.127: U1.10 7.82,5.33 8.25,5.77 9.62,5.77 9.91,6.05 9.91,7.17 10.16,7.42 11.18,7.42 12.38,8.63 17.68,8.63 18.84,9.79 18.84,10.77 17.6,12.01 17.6,16.13 17.91,16.44 v17.98,16.44
MIC_P  (via drill 0.2 pad 0.36)
  Top 0.102: J3.18 25.4,12.5
  Top 0.127: 25.4,12.5 24.38,12.5 24.13,12.75 v23.88,12.75
  Route2 0.127: v23.88,12.75 23.4,12.75 23.11,13.04 23.11,13.16 22.37,13.9 21.97,13.9 19.81,16.06 18.16,16.06 v18.01,15.9
  Bottom 0.127: U1.9 9.16,4.96 9.91,5.71 10.92,5.71 11.24,6.02 11.24,7.1 12.54,8.4 17.78,8.4 19.07,9.7 19.07,10.87 17.86,12.09 17.86,15.75 v18.01,15.9
N$1
  Top 0.305: U6.2 21.2,6.41 L4.1
  pour Top (isolate 0.254, no thermals): 20.27,6.58 19.74,6.58 19.69,6.53 19.69,6.3 19.74,6.25 20.5,6.25 20.9,5.85 21.84,5.85 21.87,5.87 21.87,7.45 21.82,7.5 20.98,7.5 20.7,7.22 20.7,6.71 20.57,6.58
N$2
  Top 0.203: X1.1 4.52,5.58 5.97,7.04 U4.17
N$3
  Bottom 0.127: Q5.3 9.65,1.45 9.91,1.71 9.91,2.21 10.29,2.59 11.05,2.59 11.56,3.1 11.81,3.1 12.7,3.99 12.7,5.77 13.36,6.43 U1.48
N$4
  Top 0.305: U6.4 20.31,7.41 20.45,7.55 20.45,8.41 R11.1 R29.2
N$5
  Bottom 0.127: TP4.T 6.22,1.96 6.98,2.72 8.25,2.72 9.02,3.48 11.43,3.48 11.96,4.01 U1.7
N$6  (via drill 0.2 pad 0.36)
  Top 0.152: C26.1 6.07,15.93 v6.1,15.9
  Bottom 0.152: U1.56 9.26,14.29 9.14,14.4 7.09,14.4 6.1,15.4 v6.1,15.9
N$8
  Bottom 0.127: TP2.T 6.86,17.83 6.86,16.06 7.11,15.8 9.14,15.8 9.21,15.74 9.26,15.69 U1.57
N$9
  Bottom 0.127: TP3.T 5.33,16.44 6.35,16.44 6.6,16.18 6.6,15.55 7.02,15.13 U1.17
N$10
  Top 0.127: R2.2 C3.2 4.47,19.76 4.7,19.99 10.28,19.99 13.63,23.35 SIM.3
N$12
  Top 0.127: R3.2 C6.2 9.04,21.07 11.09,23.13 SIM.2
N$18
  Top 0.127: Q4.1 19.17,17.79 R9.1 R14.2
N$19
  Top 0.203: U3.12 R35.1
N$20
  Top 0.127: D3.+ 18.09,14.25 R7.1
N$21
  Top 0.127: Q4.3 D3.-
N$22
  Top 0.203: U3.11 R36.1
N$23
  Top 0.254: U3.4 18.28,10.86 18.16,10.98 18.16,11.21 18.32,11.36 U3.3
  pour Top (isolate 0.254, no thermals): 18.92,9.07 18.92,8.49 18.74,8.31 17.27,8.31 17.14,8.44 17.14,9.58 17.27,9.71 18,9.71 18.29,9.99 18.29,10.87 18.42,11 19.05,11 19.18,10.87 19.18,9.32
N$24
  Top 0.203: U3.9 21.96,10.86 22.99,9.83 R37.2
N$25
  Top 0.203: R37.1 23.36,8.8 23.43,8.73 23.56,8.6 D1.-
N$31
  Top 0.127: R38.1 R39.1 20.44,8.96 U3.7
N$32  (via drill 0.2 pad 0.36)
  Top 0.127: R14.1 18.41,18.49 18.41,18.42 18.44,18.39 18.44,18.42 R14.1 | R14.1 18.03,18.47 v17.96,18.55
  Bottom 0.127: U1.64 14.76,18.7 14.91,18.55 v17.96,18.55
N$33
  Bottom 0.127: R17.1 8.25,3.1 9.02,3.86 10.92,3.86 11.3,4.24 11.3,5.54 11.53,5.77 11.81,5.77 11.96,5.92 U1.49
N$34
  Bottom 0.127: Q5.1 7.84,0.95 R13.1 R1.2
N$35
  Top 0.127: R41.1 15.01,1.73 15.11,1.83 15.81,1.83 16.7,2.72 16.7,4.44 17.4,5.13 20.57,5.13 20.7,5.01 20.7,4.14 J2.2
N$36
  Top 0.127: R42.1 15.01,2.31 15.18,2.15 15.69,2.15 16.38,2.85 16.38,4.5 17.27,5.39 20.95,5.39 21.34,5.01 J2.3
N$37
  Top 0.203: U4.16 5.09,7.54 4.64,7.99 X1.3
N$38
  Bottom 0.127: 16.16,3.13 TP1.T
  Bottom 0.305: U1.4 16.16,3.13 TP1.T
N$39
  Bottom 0.279: R18.2 C29.2 arc90 29.08,18.67 BT.1
N$40
  Bottom 0.279: 28.19,4.75 GSM.1 28.19,5.24 arc90 C22.1 R22.2
N$41
  Bottom 0.279: U1.40 22.02,8.13 22.16,7.99 22.29,7.99 22.57,7.71 arc45 24.86,6.76 C28.1 R22.1
N$42
  Bottom 0.279: R18.1 C30.2 arc45 26.54,17.83 22.86,14.15 arc-45 U1.36
N$43  (via drill 0.2 pad 0.36)
  Top 0.127: C7.2 R4.1 4.47,16.92 4.7,16.69 4.95,16.69 5.33,16.31 10.03,16.31 v10.16,16.44 | SIM.7 13.02,12.18 12,13.2 v12,13.77
  Bottom 0.127: v10.16,16.44 10.54,16.06 10.54,15.23 v12,13.77
N$45  (via drill 0.2 pad 0.36)
  Top 0.127: K1.2 5.56,1.68 v5.27,1.39
  Bottom 0.127: R15.1 5.36,1.3 v5.27,1.39 5.36,1.48 R12.1
PB1/D15/SCK  (via drill 0.2 pad 0.36)
  Top 0.127: U4.9 8.66,10.87 9.02,11.23 9.53,11.74 9.53,12.88 10.16,13.52 10.79,13.52 11.68,14.4 13.59,14.4 15.29,12.7 v15.57,12.7 | J3.4 26.53,8.3 v26.67,8.44
  Route2 0.127: v26.67,8.44 26.67,8.69 25.91,9.45 25.02,9.45 24.07,10.4 23.17,10.4 22.99,10.21 21.59,10.21 19.94,11.87 19.94,12.37 19.05,13.26 16.38,13.26 15.82,12.7 v15.57,12.7
  Bottom 0.127: 26.05,12.1 J6.2 26.05,11.75 26.27,11.75 26.8,11.23 28.32,11.23 28.96,10.6 28.96,9.45 28.7,9.2 27.81,9.2 27.05,8.44 v26.67,8.44
PB2/D16/MOSI  (via drill 0.2 pad 0.36)
  Top 0.127: U4.10 8.16,11.07 7.75,11.48 7.75,13.52 8.89,14.66 13.97,14.66 v15.37,13.26 | 25.7,9.5 J3.8 26.5,9.5 27.58,8.41 v27.66,8.41
  Route2 0.127: v15.37,13.26 16,13.26 16.26,13.52 19.18,13.52 20.19,12.5 20.19,11.99 21.72,10.47 22.86,10.47 23.05,10.65 24.2,10.65 25.15,9.71 26.04,9.71 26.92,8.82 27.25,8.82 v27.66,8.41
  Bottom 0.127: 28.05,12.01 J6.5 28.07,11.99 29.21,10.85 29.21,9.32 28.83,8.94 27.94,8.94 27.66,8.66 v27.66,8.41
PB3/D14/MISO  (via drill 0.2 pad 0.36)
  Top 0.127: U4.11 7.66,11.06 7.37,11.36 7.37,13.52 8.76,14.91 12.52,14.91 12.85,15.24 v12.85,15.48 | J3.7 27.43,9.2 v27.3,9.32
  Route2 0.127: v27.3,9.32 26.92,9.32 26.42,9.83 26.42,10.85 27.18,11.61 27.18,13.52 27.05,13.64 26.67,13.64 26.42,13.9 26.42,14.79 25.53,15.68 23.6,15.68 23.01,16.26 22.02,16.26 19.91,18.37 18.69,18.37 18.11,18.95 17.8,18.95 17.22,18.37 16.13,18.37 13.25,15.48 v12.85,15.48
  Bottom 0.127: J6.1 26.05,9.94 26.67,9.32 v27.3,9.32
PF0/A5  (via drill 0.2 pad 0.36)
  Top 0.102: J3.23 27.73,14 27.15,14.58 25.07,14.58
  Top 0.127: 25.07,14.58 24.82,14.58 v24.61,14.38 | U4.41 12.88,8.04 v12.76,7.93
  Route2 0.127: v24.61,14.38 24.31,14.38 23.57,15.12 22.5,15.12 19.71,17.91 16.33,17.91 13.79,15.37 13.79,9.73 12.76,8.7 v12.76,7.93
PF1/A4  (via drill 0.2 pad 0.36)
  Top 0.102: J3.19 28.62,12.8 28.45,12.63 27.94,12.63 27.05,13.52 26.64,13.52 26.52,13.39 25.27,13.39 v25.17,13.29
  Top 0.127: U4.40 13.07,7.54 12.92,7.38 v12.65,7.38
  Route2 0.127: v25.17,13.29 25.17,13.46 24.82,13.82 24.54,13.82 23.47,14.89 22.4,14.89 19.63,17.66 16.43,17.66 14.02,15.24 14.02,9.63 13.21,8.82 13.21,7.8 12.79,7.38 v12.65,7.38
PF4/A3  (via drill 0.2 pad 0.36)
  Top 0.127: U4.39 14.1,7.04 14.41,7.36 v14.41,7.71 | J3.20 26.73,13.1 v26.75,13.08
  Route2 0.127: v14.41,7.71 14.48,7.78 14.48,15.04 16.64,17.2 19.43,17.2 22.23,14.4 22.99,14.4 24.64,12.75 26.42,12.75 v26.75,13.08
PF5/A2  (via drill 0.2 pad 0.36)
  Top 0.127: U4.38 14.72,6.54 14.99,6.28 14.99,5.26 15.24,5.01 15.24,4.24 v15.49,3.99 15.6,3.89 R16.2 | J3.3 27.23,8 v27.18,8.05
  Route2 0.127: v15.49,3.99 15.88,3.99 | 15.88,3.99 16,3.99 | 16,3.99 16.13,3.99 | 16.13,3.99 17.78,3.99 19.56,2.21 21.08,2.21 21.59,2.72 21.59,6.7 22.82,7.93 27.05,7.93 v27.18,8.05 | 16,3.86 16,2.72 15.49,2.21 15.49,1.71 14.35,0.56 11.81,0.56 11.48,0.89 10.87,0.89 10.34,0.36 6.12,0.36 5.98,0.5 v5.97,0.5 | 16,3.86 16,3.99 | 16,3.86 15.88,3.99 | 16,3.86 16.13,3.99
  Bottom 0.127: R15.2 4.8,0.97 5.27,0.5 v5.97,0.5
PF6/A1  (via drill 0.2 pad 0.36)
  Top 0.127: U4.37 14.46,6.04 14.73,5.77 14.73,5.13 14.91,4.96 v14.91,3.86 | J3.22 24.87,13.7 v24.59,13.41
  Route2 0.127: v14.91,3.86 14.61,3.56 14.12,3.56 13.89,3.79 13.89,9.12 14.25,9.48 14.25,15.14 16.54,17.43 19.53,17.43 22.3,14.66 23.34,14.66 v24.59,13.41
PF7/A0  (via drill 0.2 pad 0.36)
  Top 0.102: J3.13 28.55,11 27.94,11.61 25.53,11.61
  Top 0.127: U4.36 14.2,5.54 14.35,5.39 v14.35,3.99 | v23.95,11.64 24.03,11.56 24.31,11.56 24.51,11.36 25.27,11.36 25.53,11.61
  Route2 0.127: v14.35,3.99 14.35,6.15 15.49,7.29 15.49,8.82 14.71,9.6 14.71,14.18 15.21,14.68 15.98,14.68 16.26,14.4 19.91,14.4 22.45,11.87 22.5,11.87 22.53,11.87 23.72,11.87 v23.95,11.64
SIM_CLK  (via drill 0.2 pad 0.36)
  Top 0.127: R2.1 3.53,19.1 v3.28,19.36
  Bottom 0.127: U1.55 9.1,12.33 8.38,11.61 7.11,11.61 6.73,11.99 5.97,11.99 3.68,14.28 3.68,18.95 v3.28,19.36
SIM_DATA  (via drill 0.2 pad 0.36)
  Top 0.127: R4.2 v3.23,16.95
  Bottom 0.127: v3.23,16.95 3.43,16.74 3.43,14.15 5.84,11.74 6.6,11.74 6.98,11.36 7.11,11.36 7.54,10.93 U1.14
SIM_RST  (via drill 0.2 pad 0.36)
  Top 0.127: v3.56,20.37 R3.1
  Bottom 0.127: v3.56,20.37 3.94,19.99 3.94,14.4 5.97,12.37 6.01,12.33 U1.15
SIM_RXD  (via drill 0.2 pad 0.36)
  Top 0.127: R8.2 17.82,22.94 Q8.3 19.04,23.28 v19.05,23.3
  Bottom 0.127: U1.31 21.86,21.97 20.11,23.72 19.47,23.72 v19.05,23.3
SIM_TXD  (via drill 0.2 pad 0.36)
  Top 0.127: R6.2 18.07,20.78 Q7.3 18.41,21.14 18.67,21.39 19.3,21.39 20.07,22.15 v20.07,22.69
  Bottom 0.127: U1.32 21.74,19.33 21.08,19.99 21.08,21.67 v20.07,22.69
SPK_N  (via drill 0.2 pad 0.36)
  Top 0.127: J3.9 27.08,9.8 v27.05,9.83
  Route2 0.127: v27.05,9.83 26.67,10.21 26.67,10.72 27.43,11.48 27.43,14.18 26.92,14.68 26.92,15.04 25.65,16.31 24.89,16.31 21.08,20.12 14.98,20.12 12.81,17.96 12.81,17.52 11.05,15.75 11.05,15.04 7.72,11.71 7.72,11.09 6.82,10.19 v6.78,10.19
  Bottom 0.127: U1.11 6.91,6.73 6.73,6.91 6.73,10.14 v6.78,10.19
SPK_P  (via drill 0.2 pad 0.36)
  Top 0.127: J3.10 26.71,10.1 v27.15,10.54
  Route2 0.127: v27.15,10.54 27.15,10.82 27.69,11.36 27.69,14.3 27.18,14.81 27.18,15.17 25.78,16.56 25.02,16.56 21.21,20.37 14.82,20.37 12.56,18.12 12.56,17.62 10.74,15.8 10.74,15.22 7.49,11.97 7.49,11.46 6.76,10.72 v6.73,10.72
  Bottom 0.127: U1.51 9.16,6.54 8.64,6.02 6.86,6.02 6.48,6.4 6.48,9.58 6.22,9.83 6.22,10.21 v6.73,10.72
VBAT
  Top 0.279: U3.16 19.44,13.65 19.69,13.9 20.07,13.9 | U3.14 20.44,13.9 | 20.44,13.9 20.44,14.27 | 20.44,14.27 C18.+ | 20.19,13.9 20.44,13.9 | 20.07,13.9 20.44,14.27 | 20.07,13.9 20.19,13.9 | 20.19,13.9 20.45,13.64
  pour Top (isolate 0.254, no thermals): 20.55,12.63 20.35,12.63 20.29,12.68 20.29,15.45 20.83,15.98 20.83,16.84 21.21,17.22 21.21,18.01 21.44,18.24 22.71,18.24 22.89,18.42 22.89,19.92 22.94,19.97 24.05,19.97 24.13,19.89 24.13,17.96 23.37,17.2 22.73,17.2 22.23,16.69 22.23,14.34 21.53,13.77 20.75,13.77 20.6,13.62 20.6,12.68
VCC_SIM  (via drill 0.2 pad 0.36)
  Top 0.229: J3.28 27.35,15.5 27.69,15.17 v28.45,15.17 28.48,15.2 J3.27
  Top 0.279: C19.2 25.44,5.49 v25.15,5.2
  Top 0.305: J10.3 1.51,8.66 3.37,8.66 v3.49,8.79 | v4.45,11.36 4.39,11.3 J1.10 3.11,11.3 2.67,11.74 2.67,13.26 3.11,13.7 J1.2 | R11.2 20.98,8.41 21.46,7.93 22.99,7.93 23.25,7.66 L4.2 | 16.57,22.47 16.57,21.96 | 16.57,21.96 16.57,20.41 16.76,20.22 R6.1 | R8.1 16.66,22.38 16.57,22.47 | 16.57,22.47 16.32,22.72 16.32,23.49 16.76,23.93 v18.61,23.93 | 16.57,21.96 16.89,22.28
  Route2 0.305: 4.57,9.71 4.57,10.47 4.32,10.72 4.32,11.23 v4.45,11.36 | 27.81,5.77 29.34,7.29 | 28.45,15.8 v28.45,15.17 28.83,15.17 | 28.45,15.8 28.45,16.69 25.4,19.74 25.4,21.64 23.16,23.88 18.66,23.88 v18.61,23.93 | 3.96,8.79 4.17,8.79 4.19,8.82 4.19,8.56 3.96,8.79 | 3.96,8.79 3.91,8.79 4.19,9.07 4.19,9.2 4.32,9.32 | 5.4,3.29 5.46,3.36 v5.71,3.36 5.71,3.1 | 28.45,15.8 29.08,15.17
  Route2 0.61: 28.58,6.15 28.45,6.15 28.07,5.77 | 4.57,9.71 4.32,9.45 | 4.32,9.45 4.32,9.32 4.32,8.82 | 4.32,8.82 4.32,8.31 | 4.32,8.31 4.32,4.37 5.4,3.29 5.59,3.1 5.59,2.08 6.83,0.84 10.03,0.84 10.58,1.39 11.75,1.39 12.07,1.07 13.84,1.07 14.05,1.27 v14.05,1.35 | 4.32,8.82 3.81,8.82 | 3.68,8.82 3.52,8.82 v3.49,8.79 | 3.68,8.82 4.32,9.45 | 3.68,8.82 3.81,8.82 | 3.81,8.82 4.32,8.31
  Route2 0.762: 28.83,15.17 29.32,14.67 29.32,12.23 29.08,11.99 29.08,8.94 29.34,8.69 29.34,6.91 28.58,6.15 28.19,5.77 28.07,5.77 27.81,5.77 25.02,5.77 v24.78,5.53 v24.77,5.53
  Bottom 0.127: C1.2 16.84,2.16 16.89,2.21 15.24,2.21 U2.3
  Bottom 0.305: R17.2 6.83,3.13 6.6,3.36 v5.71,3.36
  Bottom 0.406: 20.95,3.36 20.95,3.86 | 20.95,3.36 20.45,3.86 | 20.95,3.36 21.34,3.74
  Bottom 0.61: 20.95,3.36 20.95,2.34 20.45,1.83 19.43,1.83 18.41,2.85 17.42,2.85 C15.2 15.34,2.32 U2.3 14.73,1.83 14.25,1.35 v14.05,1.35
  other vias: 23.88,5.2 24.51,5.15 23.11,5.15 23.5,5.46
  pour Top (isolate 0.254, no thermals): 23.75,7.55 22.99,7.55 22.86,7.42 22.86,5.06 23.04,4.88 25.22,4.88 25.4,5.06 25.4,6.53 25.27,6.66 24,6.66 23.88,6.79 23.88,7.42
  pour Bottom (isolate 0.254, no thermals): 20.7,5.51 20.07,5.51 19.94,5.39 19.94,3.61 20.07,3.48 22.23,3.48 22.99,4.24 25.19,4.24 25.34,4.39 25.34,5.75 25.19,5.77 21.46,5.77 21.34,5.64 21.34,4.63 21.21,4.5 20.95,4.5 20.83,4.63 20.83,5.39
  pour Top (isolate 0.254, no thermals): 0.38,7.8 0.38,9.4 0.56,9.58 3.63,9.58 3.81,9.4 3.81,8.56 3.68,8.44 3.05,8.44 2.16,7.55 0.63,7.55
VSIM  (via drill 0.2 pad 0.36)
  Top 0.254: 11.12,12.22 11.1,12.25 11.1,12.8 10.87,13.03 v10.36,13.03 | 11.12,12.22 11.12,12.2 | 11.12,12.22 11.12,12.29 11.09,12.32
  Top 0.305: C14.1 v4.9,18.47 | C2.1 v4.95,21.77 7.16,21.77 8.55,23.17 SIM.1 | SIM.6 11.09,12.32 11.09,12.46
  Bottom 0.127: U1.16 7.58,13.73
  Bottom 0.254: v10.36,13.03 7.87,13.03 | 7.87,13.03 7.6,13.03 | 7.6,13.03 7.26,13.03 | 7.26,13.03 5.82,13.03 | 7.58,13.73 7.58,13.04 7.6,13.03 | 7.26,13.03 7.67,13.44 | 7.87,13.03 7.87,13.06 7.62,13.31
  Bottom 0.305: 5.82,13.03 4.32,14.53 4.32,18.21 | 4.32,18.21 4.32,18.47 | 4.32,18.47 4.32,18.72 | 4.32,18.72 4.32,21.26 4.83,21.77 v4.95,21.77 | v4.9,18.47 4.57,18.47 | 4.57,18.47 4.32,18.47 | 4.32,18.72 4.57,18.47 | 4.57,18.47 4.32,18.21
VSYS  (via drill 0.2 pad 0.36)
  Top 0.203: D1.+ 23.88,9.71 23.75,9.71 v23.5,9.96
  Top 0.279: U3.1 19.6,12.36 19.94,12.71 U3.15
  Top 0.305: U6.7 16.87,6.41 | L3.2 15.88,9.71 v15.62,9.96 | C27.2 16.22,4.91 15.88,4.56 TP6.T | U6.8 17.26,5.91 C21.2
  Route2 0.203: 18.92,12.25 v18.92,12.83 18.92,11.74 | 18.92,11.74 18.92,11.1 20.32,9.71 23.24,9.71 v23.5,9.96 | 18.92,11.74 18.67,11.99
  other vias: 16.13,9.96 18.49,12.8 18.72,12.45
  pour Top (isolate 0.254, no thermals): 16.76,8.31 16.76,9.65 16.2,10.21 15.4,10.21 15.11,9.93 15.11,8.31 15.37,8.05 15.8,8.05 16.26,7.6 16.26,6.79 16.13,6.66 16.13,4.88 16.38,4.88 17.02,5.51 17.65,5.51 17.91,5.77 17.91,7.17 18.03,7.29 18.8,7.29 18.92,7.42 18.92,7.8 18.8,7.93 17.14,7.93
  pour Top (isolate 0.254, no thermals): 18.31,12.37 19.18,12.37 19.18,13.01 19.05,13.13 18.48,13.13 18.31,12.97
  pour Route2 (isolate 0.254, no thermals): 15.88,9.71 15.49,9.71 15.37,9.83 15.37,11.87 16.51,13.01 19.02,13.01 19.2,12.83 19.2,12.12 18.94,11.87 16.89,11.87 16.51,11.48 16.51,9.83 16.38,9.71
VUSB  (via drill 0.2 pad 0.36)
  Top 0.254: R38.2 v19.28,9.32
  Top 0.279: U3.2 17.91,11.87 17.3,12.47 C10.1 R40.1
  Top 0.305: U4.2 12.16,11.58 v12.19,11.61 | U4.7 9.66,11.24 v10.16,11.74
  Top 0.508: C23.1 23.98,10.62 24.64,9.96 v24.64,9.07
  Route2 0.305: v10.16,11.74 12.07,11.74 v12.19,11.61
  Route2 0.406: 21.46,8.31 19.94,8.31
  Route2 0.508: v24.64,9.07 22.23,9.07 21.46,8.31 20.95,7.8 | 19.56,9.07 19.3,9.32 v19.28,9.32
  Bottom 0.305: v19.76,2.97 19.76,2.85 TP5.T
  Bottom 0.508: v12.19,11.61 15.77,11.61 v17.09,10.29
  other vias: 20.22,2.97 17.6,10.29
  pour Top (isolate 0.254, no thermals): 19.94,4.88 20.19,4.88 20.32,4.75 20.32,3.48 20.57,3.23 20.57,2.72 20.45,2.59 19.56,2.59 19.43,2.72 19.43,3.1 19.81,3.48 19.81,4.75
  pour Route2 (isolate 0.254, no thermals): 20.19,2.59 19.69,2.59 19.56,2.72 19.56,3.1 19.81,3.36 19.81,7.55 18.16,9.2 17.27,9.2 16.89,9.58 16.89,10.47 17.02,10.6 18.54,10.6 21.21,7.93 21.21,2.72 21.08,2.59
  pour Top (isolate 0.254, no thermals): 17.91,11.48 17.91,10.21 17.78,10.09 16.94,10.09 16.76,10.27 16.76,11.61 17.02,11.87 17.02,13.26 17.14,13.39 17.91,13.39 18.03,13.26 18.03,12.25 18.29,11.99 18.92,11.99 19.05,11.87 19.05,11.74 18.92,11.61 18.03,11.61

## Text on the board
tPlace: BAT | 6 | 5 | 4 | - | + | SIM | 3 | 2 | 1 | USB | K1
bPlace: RePhone core 2G | 6 | Atmel32u4 | 5 | 4 | v1.0 | 07/13/2016 | 3 | 2 | 1
tDocu: P3
Enhance: Enhance Area, / Torence +/-0.03mm, / Total Thickness = 0.2mm